# Altium schematic sheet DB10012_ControlUSBSerial.SchDoc: USB to serial
size A4; SheetNumber: 3; SheetTotal: 6
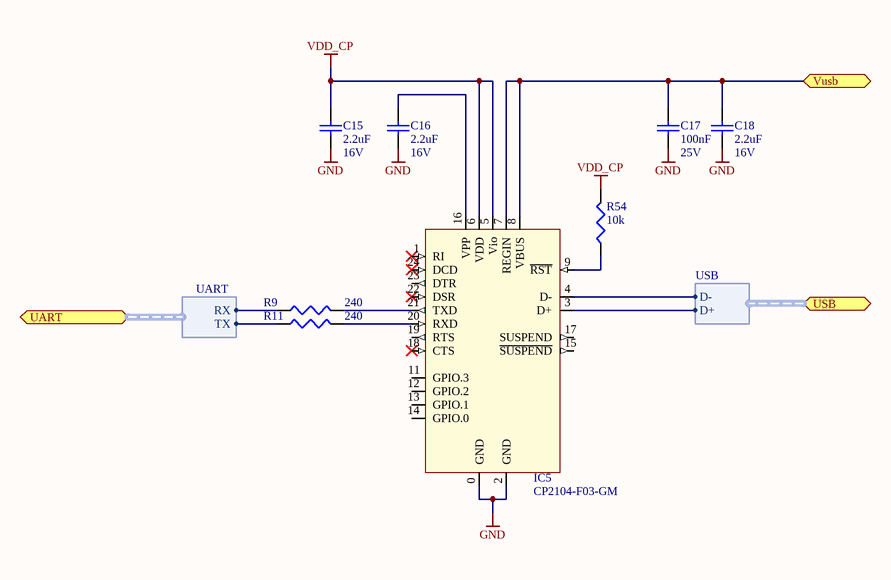
[diagram p0: DB10012_ControlUSBSerial.SchDoc]

## Parts
C15  2.2uF  Voltage Rating: 16V  [C0603]
C16  2.2uF  Voltage Rating: 16V  [C0603]
C17  100nF  Voltage Rating: 25V  [C0402]
C18  2.2uF  Voltage Rating: 16V  [C0603]
IC5  CP2104-F03-GM  [QFN24]
R9  240  [0402]
R11  240  [0402]
R54  10k  [0402]

## Ports
UART (harness UART), USB (harness USB), Vusb

## Harnesses
UART: RX, TX
USB: D-, D+

## Nets
GND: C15.1 C16.1 C17.1 C18.1 IC5.0(GND) IC5.2(GND)
VDD_CP: C15.2 IC5.5(Vio) IC5.6(VDD) R54.2
Vusb: C17.2 C18.2 IC5.7(REGIN) IC5.8(VBUS) ; port Vusb
NetC16_2: C16.2 IC5.16(VPP)
NetIC5_3: IC5.3(D+) ; port USB.D+
NetIC5_4: IC5.4(D-) ; port USB.D-
NetIC5_9: IC5.9(~{RST}) R54.1
NetIC5_20: IC5.20(RXD) R11.2
NetIC5_21: IC5.21(TXD) R9.2
NetR9_1: R9.1 ; port UART.RX
NetR11_1: R11.1 ; port UART.TX

Not connected (* = marked no-connect by the designer): IC5 1(RI)* 11(GPIO.3) 12(GPIO.2) 13(GPIO.1) 14(GPIO.0) 15(~{SUSPEND}) 17(SUSPEND) 18(CTS)* 19(RTS) 22(DSR)* 23(DTR) 24(DCD)*

## Notes on the sheet
- Title
- Size:
- Date:
- A4
- Number:
- Time:
- Revision:
- Sheet
- of
- File:

## Library data of the parts
C15 C16 C18 = 2.2uF/0603/CER/16V: Capacitor, 2.2uF, 16V, X5R; Capacitance Tolerance: +/- 10%; Capacitor Case Style: 0603; Brand Number: GRM188R61C225KE15D; Brand: MURATA; Dielectric Characteristic: X5R; Capacitance: 2.2uF; Temperature Range: -55°C to 85°C; Price: 0,077; Order Code Supplier: 1735526; Supplier: Farnell
C17 = 100nF/0402/CER/25V: Capacitor, 100nF, 25V, X7R; Capacitance Tolerance: 10nF; Capacitor Case Style: 0402; Brand Number: GRM155R71E104KE14D; Brand: MULTICOMP; Dielectric Characteristic: X7R; Capacitance: 100nF; Temperature Range: -55 to +125 C; Price: 0,0225; Order Code Supplier: 2456106; Supplier: Farnell
IC5 = CP2104-F03-GM: USB to UART converter; Case Style: QFN24; Price: 1,65; Order Code Supplier: 757-4983; Brand Number: CP2104-F03-GM; Supplier: RS-Components
R9 R11 = 240/0402/0063W/50V: Resistor, 240, 0.1%, 0.0625W, 50V, 100PPM, 0402; Brand: VISHAY DRALORIC; Brand Number: CRCW0402240RFKED; Power Rating: 0.063W; Case Style: 0402; Order Code Supplier: 2121522; Price: 0,0006; Resistance: 240; Supplier: Farnell; Temperature Coefficient: ± 100PPM; Temperature Range: -55°C to +125°C; Voltage Rating: 50V
R54 = 10k/0402/0063W/50V: Resistor, 10k, 0.1%, 0.0625W, 50V, 100PPM, 0402; Brand: VISHAY DRALORIC; Brand Number: CRCW040210K0FKED; Power Rating: 0.063W; Case Style: 0402; Order Code Supplier: 2121730; Price: 0,0005; Resistance: 10k; Supplier: Farnell; Temperature Coefficient: ± 100PPM; Temperature Range: -55°C to +125°C; Voltage Rating: 50V